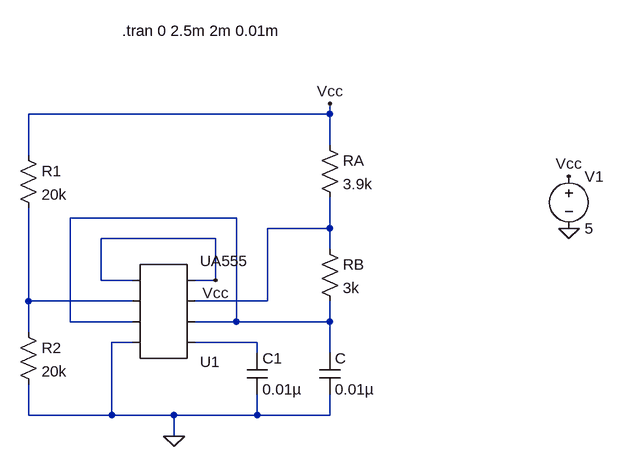
[diagram p0: schematic LM555.asc]
LM555.asc, the LTspice schematic file:
Version 4
SHEET 1 1076 680
WIRE 112 -160 112 -176
WIRE 112 -160 -352 -160
WIRE 112 -112 112 -160
WIRE -352 -96 -352 -160
WIRE -32 0 -288 0
WIRE 112 16 112 -32
WIRE 112 16 16 16
WIRE -64 32 -240 32
WIRE 112 48 112 16
WIRE -240 96 -240 32
WIRE -192 96 -240 96
WIRE -64 96 -64 32
WIRE -64 96 -96 96
WIRE -352 128 -352 -16
WIRE -192 128 -352 128
WIRE 16 128 16 16
WIRE 16 128 -96 128
WIRE -288 160 -288 0
WIRE -192 160 -288 160
WIRE -32 160 -32 0
WIRE -32 160 -96 160
WIRE 112 160 112 128
WIRE 112 160 -32 160
WIRE -352 176 -352 128
WIRE -192 192 -224 192
WIRE 0 192 -96 192
WIRE 0 208 0 192
WIRE 112 208 112 160
WIRE -352 304 -352 256
WIRE -224 304 -224 192
WIRE -224 304 -352 304
WIRE -128 304 -224 304
WIRE 0 304 0 272
WIRE 0 304 -128 304
WIRE 112 304 112 272
WIRE 112 304 0 304
WIRE -128 336 -128 304
FLAG -128 336 0
FLAG 112 -176 Vcc
FLAG 480 16 0
FLAG 480 -64 Vcc
FLAG -64 96 Vcc
SYMBOL AutoGenerated/UA555 -144 144 M180
SYMATTR InstName U1
SYMBOL cap -16 208 R0
SYMATTR InstName C1
SYMATTR Value 0.01µ
SYMBOL cap 96 208 R0
SYMATTR InstName C
SYMATTR Value 0.01µ
SYMBOL res 96 32 R0
SYMATTR InstName RB
SYMATTR Value 3k
SYMBOL res 96 -128 R0
SYMATTR InstName RA
SYMATTR Value 3.9k
SYMBOL voltage 480 -80 R0
SYMATTR InstName V1
SYMATTR Value 5
SYMBOL res -368 -112 R0
SYMATTR InstName R1
SYMATTR Value 20k
SYMBOL res -368 160 R0
SYMATTR InstName R2
SYMATTR Value 20k
TEXT -208 -288 Left 2 !.tran 0 2.5m 2m 0.01m

The netlist it stands for:
* LM555.asc
* U1: UA555 (symbol AutoGenerated/UA555 not available, pins judged from their places): pin1=0 pin2=N001 pin3=N003 pin4=Vcc pin5=N004 pin6=N001 pin7=N002 pin8=Vcc
C1 N004 0 0.01µ
C N001 0 0.01µ
RB N002 N001 3k
RA Vcc N002 3.9k
V1 Vcc 0 5
R1 Vcc N003 20k
R2 N003 0 20k
.tran 0 2.5m 2m 0.01m
.backanno
.end